# EAGLE schematic MAX31850K_breakout (EAGLE 6.3)
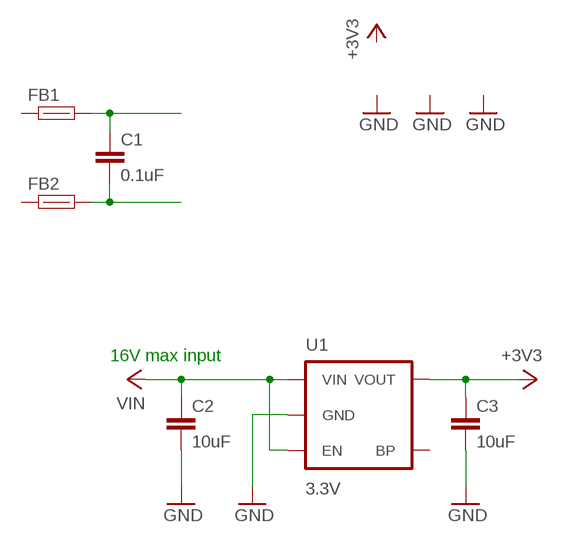
[diagram p0: schematic, sheet 1]

## Parts
C1  0.1uF  0.1UF-16V-0603  [0603-CAP]
C2  10uF  10UF-35V-1206  [1206-CAP]
C3  10uF  10UF-6.3V-0805  [0805-CAP]
FB1  FB-1K-100MHZ-0603  [0603-RES]
FB2  FB-1K-100MHZ-0603  [0603-RES]
U1  3.3V  LP2985-33DBVR  [SOT23-5]

## Nets
+3V3: C2.P$3 C3.P$1 U1.1(VIN) U1.3(EN) U1.5(VOUT) ; supply symbol labelled VIN
GND: C2.P$4 C3.P$2 U1.2(GND)
N$1: C1.P$1
N$2: C1.P$2
Unconnected: FB1.P$1 FB1.P$2 FB2.P$1 FB2.P$2 U1.4(BP)

## Notes on the sheet
- 16V max input

## Library data of the parts
C1 = LoganSmith-Capacitors:0.1UF-*-?: 0.1uF ceramic capacitors; DIGIKEY_OC: 1276-1005-1-ND; MFR: Samsung Electro-Mechanics America, Inc; MPN: CL10B104KO8NNNC; TEMP_COEFF: X7R; TEMP_RANGE: -55C to 125C; THICK: 0.90mm; TOL: +/-10%
C2 = LoganSmith-Capacitors:10UF-*-?; DIGIKEY_OC: 1276-3103-1-ND; MFR: Samsung Electro-Mechanics America, Inc; MPN: CL31B106KLHNNNE; TEMP_COEFF: X7R; TEMP_RANGE: -55C to 125C; THICK: 1.80mm; TOL: +/-10%
C3 = LoganSmith-Capacitors:10UF-*-?; DIGIKEY_OC: 1276-1113-1-ND; MFR: Samsung Electro-Mechanics America, Inc; MPN: CL21B106KQQNNNE; TEMP_COEFF: X7R; TEMP_RANGE: -55C to 125C; THICK: 1.40mm; TOL: +/-10%
FB1 FB2 = LoganSmith-Inductors:FB-1K-100MHZ-?: 1k@100MHz ferrite bead; CURRENT_RATING: 250mA; DC_RES: 600mOhm(max); DIGIKEY_OC: 1276-6378-1-ND; HEIGHT: 0.95mm; MFR: Samsung Electro-Mechanics America, Inc.; MPN: CIM10J102NC; VALUE: 1kOhm@100MHz
U1 = LoganSmith-Power_IC:LP2985*-?: Fixed output Texas Instruments LDO Datasheet <http://www.ti.com/lit/ds/symlink/lp2985-18.pdf> Features Output Tolerance of 1% (A Grade) 1.5% (Standard Grade) Ultra-Low Dropout, Typically 280 mV at Full Load of 150 mA 7 mV at 1 mA Wide VIN Range: 16 V Max; DIGIKEY_OC: 296-18476-1-ND; MFR: Texas Instruments; MPN: LP2985-33DBVR; TEMP_RANGE: -40C to 125C